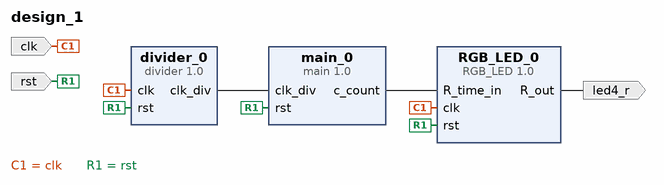
[diagram p0: block diagram of the top level]
# Vivado block design design_1, xc7z020clg400-1, Vivado 2018.3
create_bd_design design_1

create_bd_port -dir I -type rst rst
set_property -dict {CONFIG.POLARITY ACTIVE_HIGH} [get_bd_ports rst]
create_bd_port -dir I -type clk clk
create_bd_port -dir O -type data led4_r

create_bd_cell -type ip -vlnv xilinx.com:user:divider:1.0 divider_0
create_bd_cell -type ip -vlnv xilinx.com:user:main:1.0 main_0
create_bd_cell -type ip -vlnv xilinx.com:user:RGB_LED:1.0 RGB_LED_0

# ---- connections ----

connect_bd_net [get_bd_pins divider_0/clk_div] [get_bd_pins main_0/clk_div]
connect_bd_net [get_bd_pins main_0/c_count] [get_bd_pins RGB_LED_0/R_time_in]
connect_bd_net [get_bd_ports clk] [get_bd_pins divider_0/clk] [get_bd_pins RGB_LED_0/clk]
connect_bd_net [get_bd_ports rst] [get_bd_pins divider_0/rst] [get_bd_pins main_0/rst] [get_bd_pins RGB_LED_0/rst]
connect_bd_net [get_bd_pins RGB_LED_0/R_out] [get_bd_ports led4_r]

validate_bd_design
save_bd_design
